# EAGLE design rfboard (EAGLE 6.5.0)
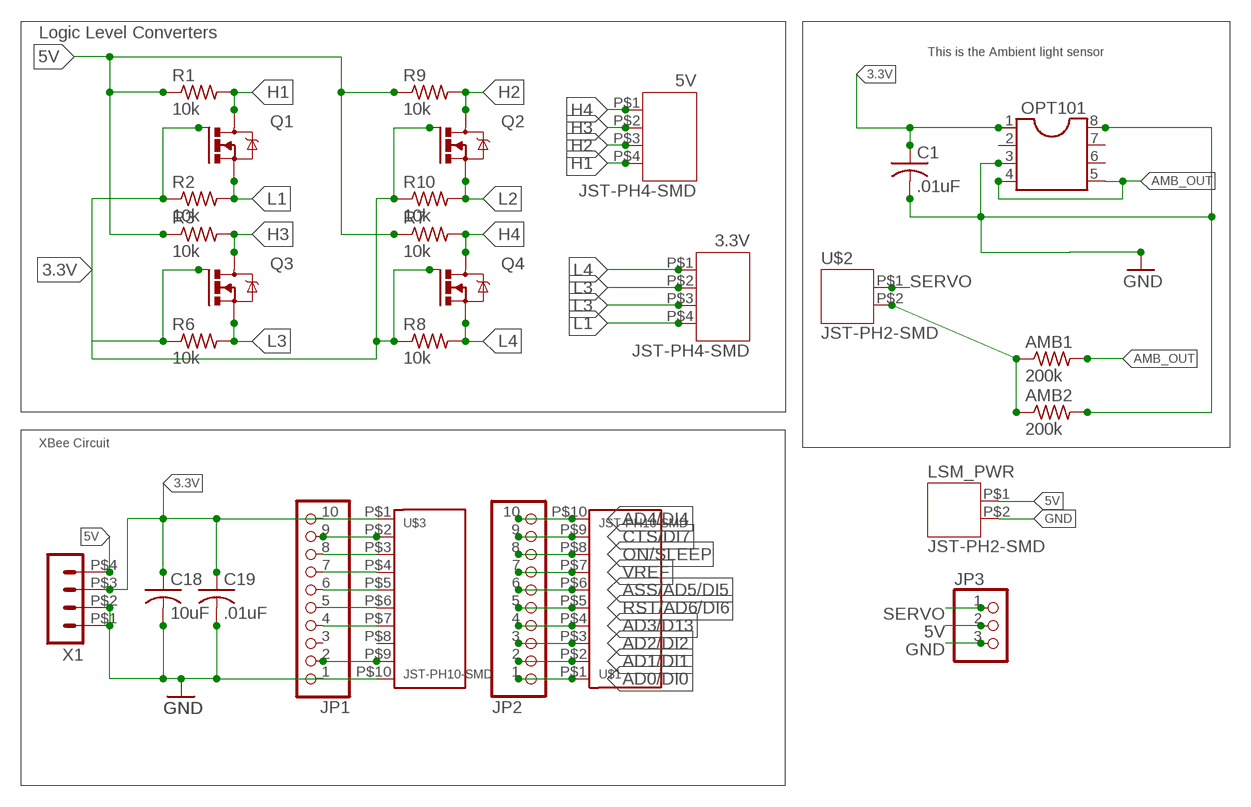
[diagram p0: schematic, sheet 1]

## Parts
3.3V  JST-PH4-SMD  [JST-PH4-SMD]
5V  JST-PH4-SMD  [JST-PH4-SMD]
AMB1  200k  R-US_R0805  [R0805]
AMB2  200k  R-US_R0805  [R0805]
C1  .01uF  C-USC0805K  [C0805K]
C18  10uF  C-USC1206K  [C1206K]
C19  .01uF  C-USC0805K  [C0805K]
JP1  PINHD-1X10_2.00  [1X10M]
JP2  PINHD-1X10_2.00  [1X10M]
JP3  PINHD-1X3  [1X03]
LSM_PWR  JST-PH2-SMD  [JST-PH2-SMD]
OPT101  DIL8  [DIL08]
Q1  IRLML5203  [MICRO3]
Q2  IRLML5203  [MICRO3]
Q3  IRLML5203  [MICRO3]
Q4  IRLML5203  [MICRO3]
R1  10k  R-US_R0805  [R0805]
R2  10k  R-US_R0805  [R0805]
R3  10k  R-US_R0805  [R0805]
R6  10k  R-US_R0805  [R0805]
R7  10k  R-US_R0805  [R0805]
R8  10k  R-US_R0805  [R0805]
R9  10k  R-US_R0805  [R0805]
R10  10k  R-US_R0805  [R0805]
U$1  JST-PH10-SMD  [JST-PH10-SMD]
U$2  JST-PH2-SMD  [JST-PH2-SMD]
U$3  JST-PH10-SMD  [JST-PH10-SMD]
X1  HEADER_POS4_43045-0406  [43045-0406]

## Nets
3.3V [power]: C1.1 C18.1 C19.1 JP1.10 OPT101.1 Q1.1(G) Q2.1(G) Q3.1(G) Q4.1(G) R2.1 R6.1 R8.1 R10.1 U$3.P$1 X1.P$3
5V [power]: JP3.2 LSM_PWR.P$1 R1.1 R3.1 R7.1 R9.1 X1.P$4
AD0/DI0: JP2.1 U$1.P$1
AD1/DI1: JP2.2 U$1.P$2
AD2/DI2: JP2.3 U$1.P$3
AD3/D13: JP2.4 U$1.P$4
AD4/DI4: JP2.10 U$1.P$10
AMB_LOW: AMB1.1 AMB2.1 U$2.P$2
AMB_OUT: AMB1.2 OPT101.4 OPT101.5
ASS/AD5/DI5: JP2.6 U$1.P$6
CTS/DI7: JP2.9 U$1.P$9
DIN/CONFIG: JP1.8 U$3.P$3
DO8: JP1.7 U$3.P$4
DOUT: JP1.9 U$3.P$2
DTR/SLEEP_RQ/D18: JP1.2 U$3.P$9
GND [power]: AMB2.2 C1.2 C18.2 C19.2 JP1.1 JP3.3 LSM_PWR.P$2 OPT101.3 OPT101.8 U$3.P$10 X1.P$1 X1.P$2
H1: 5V.P$4 Q1.3(D) R1.2
H2: 5V.P$3 Q2.3(D) R9.2
H3: 5V.P$2 Q3.3(D) R3.2
H4: 5V.P$1 Q4.3(D) R7.2
L1: 3.3V.P$4 Q1.2(S) R2.2
L2: 3.3V.P$3 Q2.2(S) R10.2
L3: 3.3V.P$2 Q3.2(S) R6.2
L4: 3.3V.P$1 Q4.2(S) R8.2
ON/SLEEP: JP2.8 U$1.P$8
PWM0/RSSI: JP1.5 U$3.P$6
PWM1: JP1.4 U$3.P$7
RESET: JP1.6 U$3.P$5
RST/AD6/DI6: JP2.5 U$1.P$5
SERVO: JP3.1 U$2.P$1
VREF: JP2.7 U$1.P$7
Unconnected: JP1.3 OPT101.2 OPT101.6 OPT101.7 U$3.P$8

## Notes on the sheet
- Logic Level Converters
- This is the Ambient light sensor
- XBee Circuit

## Library data of the parts
3.3V 5V = jst-ph:JST-PH4-SMD
AMB1 AMB2 R1-R3 R6-R10 = resistor:R-US_: RESISTOR, American symbol
C1 C18 C19 = rcl:C-US: CAPACITOR, American symbol
JP1 JP2 = pinhead-2:PINHD-1X10: PIN HEADER
JP3 = pinhead:PINHD-1X3: PIN HEADER
LSM_PWR U$2 = jst-ph:JST-PH2-SMD: Surface mount 2pin PH top entry part. http://www.jst-mfg.com/product/pdf/eng/ePH.pdf
OPT101 = ic-package:DIL8: Dual In Line / Socket
Q1-Q4 = ngohara_parts:IRLML5203: BSS138 N-Channel Power MOSFET
U$1 U$3 = jst-ph:JST-PH10-SMD
X1 = con-molex-micro-fit-3_0:HEADER_POS4_?: Molex - Micro-Fit 3.0 Series connector, 3.00mm (0.118") pitch header, 4 positions.

## Net classes
0 default: width 0.254 mm, drill 0.508 mm, clearance 0.254 mm
1 power: width 0.508 mm, drill 0.508 mm, clearance 0.508 mm

## Board
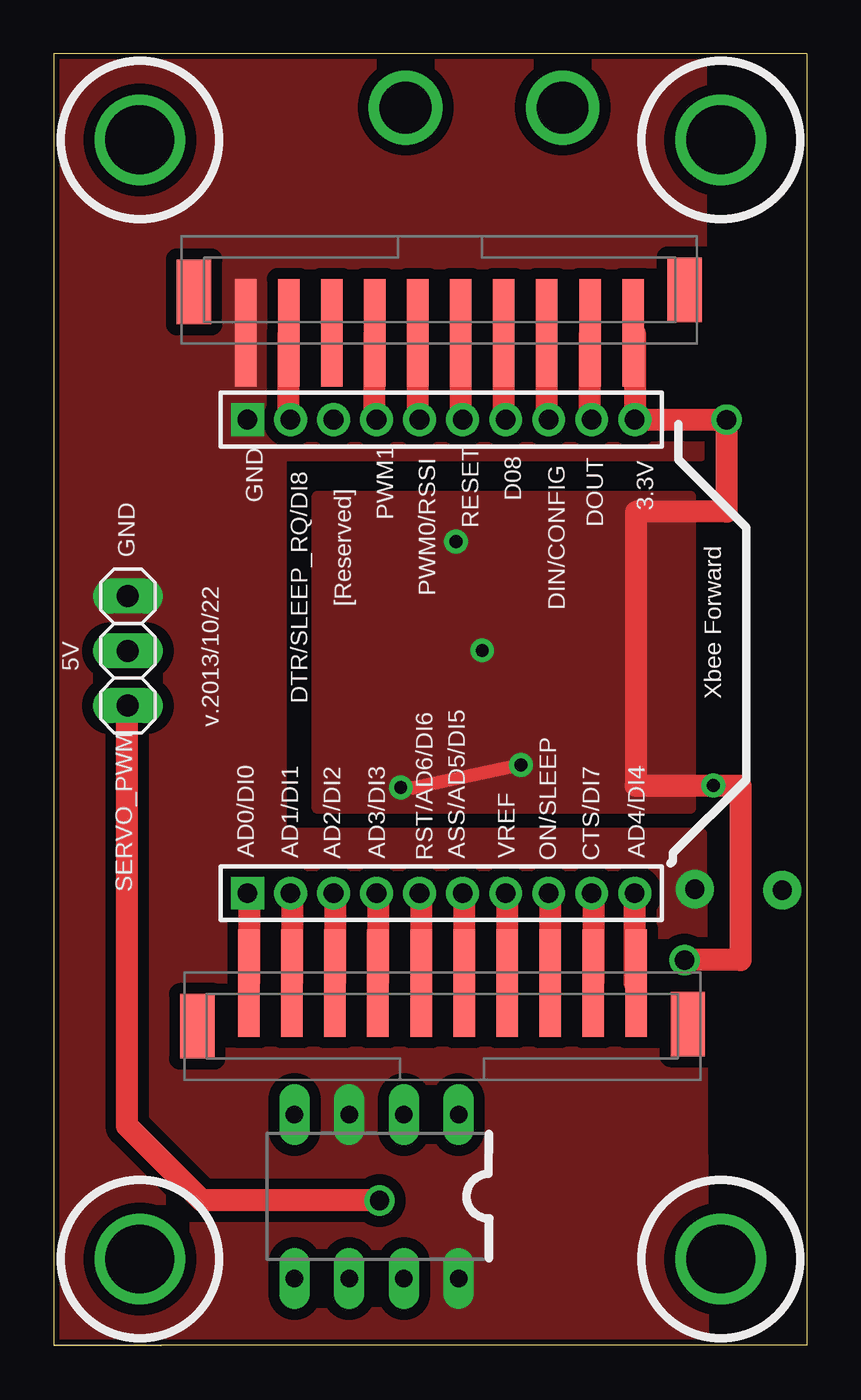
[diagram p1: board, top side]
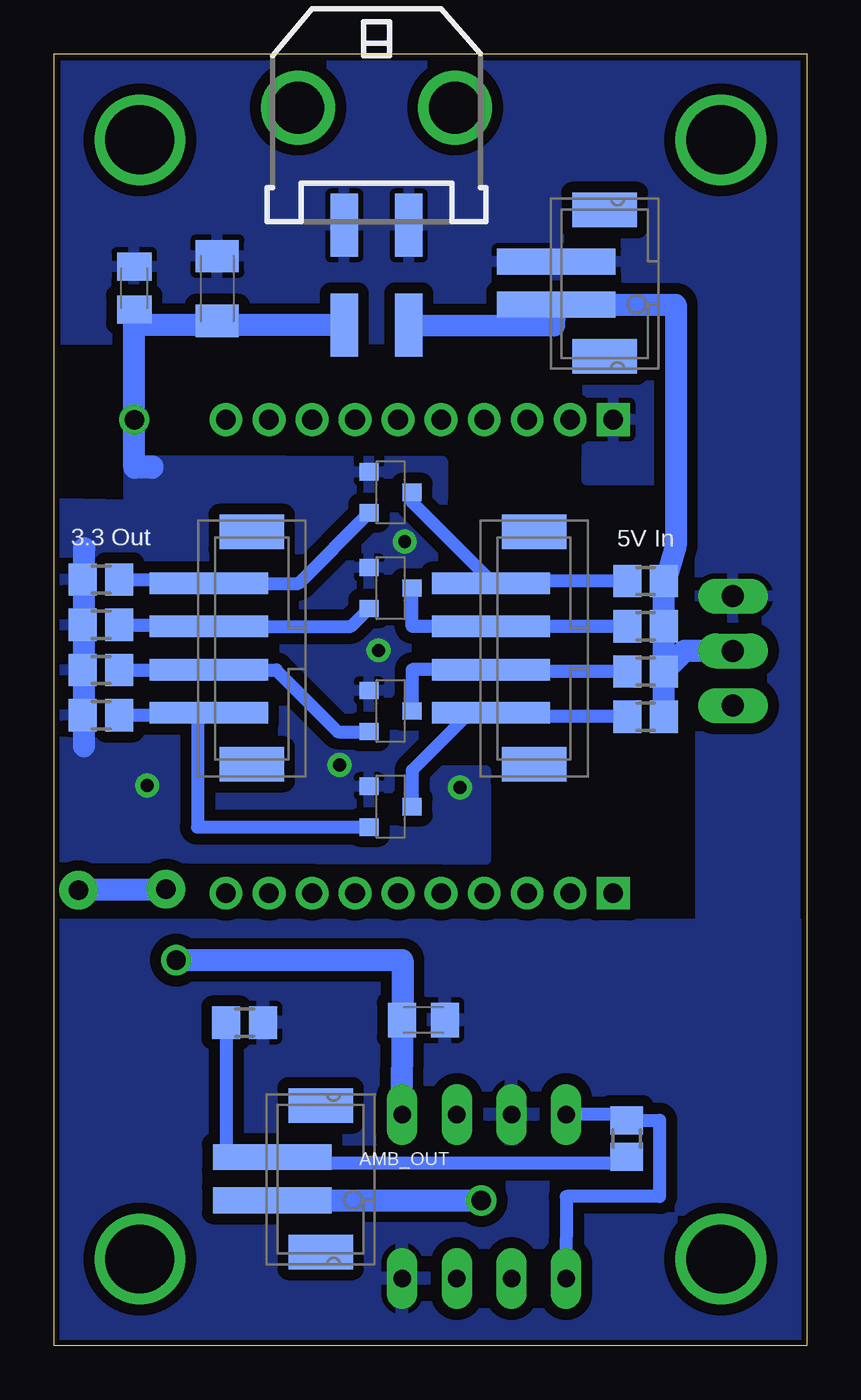
[diagram p2: board, bottom side, seen from below]

Size 35 x 60.03 mm. Coordinates in mm from the lower left corner, seen from the top.
Outline: 0,0.03 5,0
Outline: 0,0.03 35,0.03 35,60.03 0,60.03 0,0.03
Copper layers (1*16): Top 0.035mm / dielectric 1.5mm / Bottom 0.035mm
Design rules "SparkFun": minimum track width 8mil, minimum drill 20mil, track to track 8mil, track to pad 8mil, pad to pad 8mil, via to via 8mil, smd to smd 8mil, copper to edge 10mil, drill to drill 8mil, minimum pad ring 12mil, minimum via ring 10mil, stop-mask expansion 4mil, vias tented up to drill 25mil, thermal gap 10mil

### Footprints (pad centres in the part's own frame; a part is rotated, then mirrored left to right if it is on the bottom)
JST-PH4-SMD = smd 1 x 5.5: P$1 2.975,4.5; P$2 4.975,4.5; P$3 6.975,4.5; P$4 8.975,4.5 | smd 1.6 x 3: P$5 0.575,2.5; P$6 11.375,2.5
R0805 = smd 1.3 x 1.5: 1 -0.85,0; 2 0.85,0
C0805K = smd 1.3 x 1.6: 1 -1,0; 2 1,0
C1206K = smd 1.5 x 2: 1 -1.5,0; 2 1.5,0
1X10M = drill 0.914 square: 1 -9,0 | drill 0.914: 2 -7,0; 3 -5,0; 4 -3,0; 5 -1,0; 6 1,0; 7 3,0; 8 5,0; 9 7,0; 10 9,0
1X03 = drill 1.016 long: 1 -2.54,0; 2 0,0; 3 2.54,0
JST-PH2-SMD = smd 1.6 x 3: MOUNT1 0.575,2.5; MOUNT2 7.375,2.5 | smd 1.2 x 5.5: P$1 2.975,4.75; P$2 4.975,4.75
DIL08 = drill 0.813 long: 1 -3.81,-3.81; 2 -1.27,-3.81; 3 1.27,-3.81; 4 3.81,-3.81; 5 3.81,3.81; 6 1.27,3.81; 7 -1.27,3.81; 8 -3.81,3.81
MICRO3 = smd 0.8 x 0.9: 1 -0.95,-1; 2 0.95,-1; 3 0,1
JST-PH10-SMD = smd 1 x 5: P$1 2.975,4.5; P$2 4.975,4.5; P$3 6.975,4.5; P$4 8.975,4.5; P$5 10.975,4.5; P$6 12.975,4.5; P$7 14.975,4.5; P$8 16.975,4.5; P$9 18.975,4.5; P$10 20.975,4.5 | smd 1.6 x 3: P$11 0.575,2.5; P$12 23.375,2.6
43045-0406 = smd 1.27 x 2.92: P$1 1.5,5.47; P$2 -1.5,5.47; P$3 1.5,10.1; P$4 -1.5,10.1 | drill 2.41: P$5 -3.65,0; P$6 3.65,0

### Placement (x,y rotation side)
3.3V  23.3,26.44 90 bottom
5V  10.18,26.44 90 bottom
AMB1  8.38,9.63 90 bottom
AMB2  26.13,15.01 0 bottom
C1  17.82,15.13 0 bottom
C18  27.4,49.12 90 bottom
C19  31.26,49.14 90 bottom
JP1  18,43.03 0 top
JP2  18,21.03 0 top
JP3  3.44,32.29 90 top
LSM_PWR  6.9,45.39 90 bottom
OPT101  15,6.93 180 top
Q1  19.35,39.65 270 bottom
Q2  19.35,35.2 270 bottom
Q3  19.35,29.49 270 bottom
Q4  19.35,25.04 270 bottom
R1  7.5,35.53 180 bottom
R2  32.8,35.6 0 bottom
R3  7.5,31.33 180 bottom
R6  32.8,31.4 0 bottom
R7  7.5,29.23 180 bottom
R8  32.8,29.3 0 bottom
R9  7.5,33.43 180 bottom
R10  32.8,33.5 0 bottom
U$1  6.09,12.34 0 top
U$2  20.1,3.78 90 bottom
U$3  29.89,51.56 180 top
X1  20,57.53 180 bottom

### Tracks (layer width: path | path; a pad name or v marks a point on that pad's centre or on a via)
3.3V  (via drill 0.6, 0.9)
  Top 0.61: v21.71,26.97 16.71,25.91 v16.12,25.93
  Top 1.016: v29.31,17.92 31.91,17.92 31.91,26.03 27.05,26.03 27.06,38.69 27.06,38.75 31.26,38.75 v31.26,43.03 JP1.10 27,47.06 U$3.P$1
  Bottom 0.508: C18.1 27.86,47.78 27.86,47.43
  Bottom 0.61: 18.8,15.15 C1.1
  Bottom 1.016: X1.P$3 27.86,47.43 31.26,47.43 | 31.26,47.43 C19.1 | 31.26,42.88 v31.26,43.03 31.26,47.43 | 31.26,40.87 30.43,40.87 30.43,40.79 31.26,40.79 31.26,40.87 | 31.26,40.87 31.26,42.72 | 33.58,37.06 33.6,37.06 33.6,27.86 | C1.1 18.84,10.75 OPT101.1 | v29.31,17.92 18.8,17.92 18.8,15.15
  other vias: 30.65,26.03 18.69,37.36 19.91,32.31
  pour Bottom: 16.94,41.1 17.04,26.72 14.93,26.72 14.93,22.6 16.89,22.6 34.69,22.65 34.74,39.14 31.5,39.09 31.5,41.15
  pour Top: 12.24,39.47 29.59,39.47 29.59,24.97 12.24,24.97
5V
  Bottom 1.016: X1.P$4 11.76,47.4 LSM_PWR.P$1 6.1,48.36 6.1,37.19 6.58,35.53 R1.1 R9.1 R3.1 | R7.1 R3.1 | JP3.2 5.69,32.29 R3.1
AD0/DI0
  Top 1.016: JP2.1 9.07,21.03 U$1.P$1
AD1/DI1
  Top 1.016: JP2.2 11.07,21.03 U$1.P$2
AD2/DI2
  Top 1.016: JP2.3 13.07,21.03 U$1.P$3
AD3/D13
  Top 1.016: JP2.4 15.07,21.03 U$1.P$4
AD4/DI4
  Top 1.016: U$1.P$10 27,16.84 JP2.10
AMB_LOW
  Bottom 0.61: AMB2.1 26.98,8.8 U$2.P$2 26.44,8.76 26.44,8.48 8.68,8.48 AMB1.1
AMB_OUT
  Bottom 0.61: OPT101.4 8.68,10.74 AMB1.2 6.85,10.48 6.85,6.93 11.19,6.93 OPT101.5
ASS/AD5/DI5
  Top 1.016: JP2.6 19.07,21.03 U$1.P$6
CTS/DI7
  Top 1.016: JP2.9 25.07,21.03 U$1.P$9
DIN/CONFIG
  Top 1.016: JP1.8 22.92,43.03 U$3.P$3
DO8
  Top 1.016: JP1.7 20.92,43.03 U$3.P$4
DOUT
  Top 1.016: JP1.9 24.92,43.03 U$3.P$2
DTR/SLEEP_RQ/D18
  Top 1.016: JP1.2 10.92,43.03 U$3.P$9
GND  (via drill 0.9 pad 1.78)
  Bottom 0.508: 33.45,21.18 33.45,21.36 v33.85,21.16
  Bottom 0.61: 29.79,21.18 v29.79,21.21
  Bottom 1.016: 29.79,21.18 33.45,21.18 33.8,21.18
  pour Bottom (isolate 0.305): -0.02,18.92 4.94,18.92 4.96,40.23 10.22,40.23 10.15,46.76 34.97,46.71 35.15,60.07 0,59.97
  pour Top (isolate 0.254, no thermals): -5,-0.03 30.12,-0.05 30.18,-0.05 30.07,23.75 10.54,23.75 10.54,41.4 30.05,41.4 30.05,41.94 30.07,60.05 0,60.05 -0.05,59.99 -5,59.99
  pour Bottom: 35,19.53 35.15,-0.08 0,-0.08 0,19.53
H1
  Bottom 0.61: R1.2 14.68,35.53 | 14.68,35.53 5V.P$4 | 14.68,35.53 18.35,39.19 Q1.3
H2
  Bottom 0.61: R9.2 5V.P$3 | 5V.P$3 | 5V.P$3 18.35,33.43 Q2.3
H3
  Bottom 0.61: R3.2 14.68,31.33 5V.P$2 18.35,31.42 Q3.3
H4
  Bottom 0.61: R7.2 14.68,29.23 5V.P$1 15.67,29.42 18.35,26.73 Q4.3
L1
  Bottom 0.61: R2.2 28.37,35.6 28.37,35.41 3.3V.P$4 23.63,35.42 Q1.2
L2
  Bottom 0.61: R10.2 27.8,33.5 3.3V.P$3 21.19,33.42 Q2.2
L3
  Bottom 0.61: R6.2 27.8,31.4 | 27.8,31.4 3.3V.P$2 | 27.8,31.4 24.66,31.4 21.79,28.52 20.37,28.52 Q3.2
L4
  Bottom 0.61: 28.32,29.3 28.32,29.44 27.8,29.44 3.3V.P$1 | R8.2 28.32,29.3 | 28.32,29.3 28.32,24.09 Q4.2
N$19  (via drill 3.2)
  other vias: 4,56.03
N$20  (via drill 3.2)
  other vias: 31,56.03
N$21  (via drill 3.2)
  other vias: 4,4.03
N$22  (via drill 3.2)
  other vias: 31,4.03
ON/SLEEP
  Top 1.016: JP2.8 23.07,21.03 U$1.P$8
PWM0/RSSI
  Top 1.016: JP1.5 16.92,43.03 U$3.P$6
PWM1
  Top 1.016: JP1.4 14.92,43.03 U$3.P$7
RESET
  Top 1.016: JP1.6 18.92,43.03 U$3.P$5
RST/AD6/DI6
  Top 1.016: JP2.5 17.07,21.03 U$1.P$5
SERVO  (via drill 0.9 pad 1.02)
  Top 1.016: v15.14,6.75 6.86,6.75 3.4,10.21 3.4,29.71 JP3.1
  Bottom 0.61: 26.96,6.75 U$2.P$1
  Bottom 1.016: U$2.P$1 15.14,6.76 v15.14,6.75
VREF
  Top 1.016: JP2.7 21.07,21.03 U$1.P$7

### Text on the board
tPlace: Xbee Forward
tNames: DOUT | GND | D08 | 3.3V | PWM1 | RESET | GND | PWM0/RSSI | [Reserved] | DIN/CONFIG | 5V | DTR/SLEEP_RQ/DI8 | v.2013/10/22 | AD0/DI0 | AD1/DI1 | AD2/DI2 | AD3/DI3 | RST/AD6/DI6 | ASS/AD5/DI5 | VREF | ON/SLEEP | CTS/DI7 | AD4/DI4 | SERVO_PWM
bNames: 5V In | 3.3 Out | AMB_OUT
tValues: PERIPHERALS BOARD